# EAGLE design picker bot (EAGLE 9.6.2)
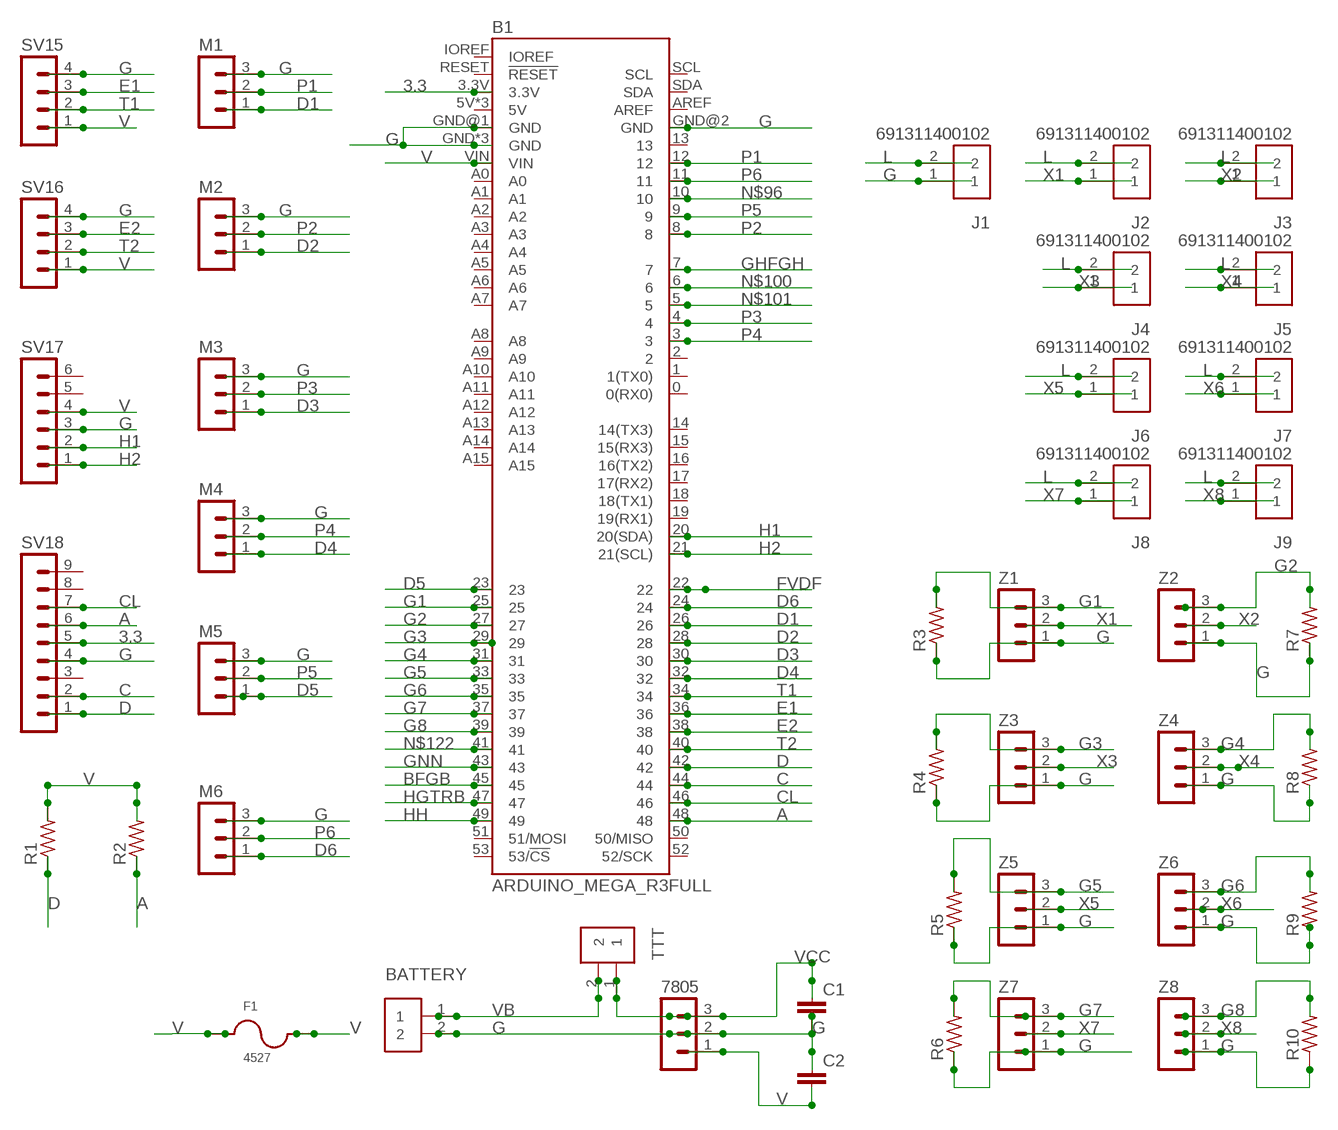
[diagram p0: schematic, sheet 1]

## Parts
7805  MA03-1  [MA03-1]
B1  ARDUINO_MEGA_R3FULL  [ARDUINO_MEGA_NO_SILK]
BATTERY  691311400102  [TERMINALBLOCK_PLUGGABLE-2-7.62MM]
C1  C-EU025-024X044  [C025-024X044]
C2  C-EU025-024X044  [C025-024X044]
F1  4527  [4527]
J1  691311400102  [TERMINALBLOCK_PLUGGABLE-2-7.62MM]
J2  691311400102  [TERMINALBLOCK_PLUGGABLE-2-7.62MM]
J3  691311400102  [TERMINALBLOCK_PLUGGABLE-2-7.62MM]
J4  691311400102  [TERMINALBLOCK_PLUGGABLE-2-7.62MM]
J5  691311400102  [TERMINALBLOCK_PLUGGABLE-2-7.62MM]
J6  691311400102  [TERMINALBLOCK_PLUGGABLE-2-7.62MM]
J7  691311400102  [TERMINALBLOCK_PLUGGABLE-2-7.62MM]
J8  691311400102  [TERMINALBLOCK_PLUGGABLE-2-7.62MM]
J9  691311400102  [TERMINALBLOCK_PLUGGABLE-2-7.62MM]
M1  MA03-1  [MA03-1]
M2  MA03-1  [MA03-1]
M3  MA03-1  [MA03-1]
M4  MA03-1  [MA03-1]
M5  MA03-1  [MA03-1]
M6  MA03-1  [MA03-1]
R1  R-US_0204/5  [0204/5]
R2  R-US_0204/5  [0204/5]
R3  R-US_0204/5  [0204/5]
R4  R-US_0204/5  [0204/5]
R5  R-US_0204/5  [0204/5]
R6  R-US_0204/5  [0204/5]
R7  R-US_0204/5  [0204/5]
R8  R-US_0204/5  [0204/5]
R9  R-US_0204/5  [0204/5]
R10  R-US_0204/5  [0204/5]
SV15  MA04-1  [MA04-1]
SV16  MA04-1  [MA04-1]
SV17  MA06-1  [MA06-1]
SV18  MA09-1  [MA09-1]
TTT  691311400102  [TERMINALBLOCK_PLUGGABLE-2-7.62MM]
Z1  MA03-1  [MA03-1]
Z2  MA03-1  [MA03-1]
Z3  MA03-1  [MA03-1]
Z4  MA03-1  [MA03-1]
Z5  MA03-1  [MA03-1]
Z6  MA03-1  [MA03-1]
Z7  MA03-1  [MA03-1]
Z8  MA03-1  [MA03-1]

## Nets
3.3: B1.3.3V SV18.5
A: B1.48 R2.1 SV18.6
BFGB: B1.45
C: B1.44 SV18.2
CL: B1.46 SV18.7
D: B1.42 R1.1 SV18.1
D1: B1.26 M1.1
D2: B1.28 M2.1
D3: B1.30 M3.1
D4: B1.32 M4.1
D5: B1.23 M5.1
D6: B1.24 M6.1
E1: B1.36 SV15.3
E2: B1.38 SV16.3
FVDF: B1.22
G: 7805.2 B1.GND B1.GND@1(GND) B1.GND@2(GND) B1.GND@3(GND) B1.GND@4(GND) BATTERY.2 C1.2 C2.1 J1.1 M1.3 M2.3 M3.3 M4.3 M5.3 M6.3 R3.1 R4.1 R5.1 R6.1 R7.1 R8.1 R9.1 R10.1 SV15.4 SV16.4 SV17.3 SV18.4 Z1.1 Z2.1 Z3.1 Z4.1 Z5.1 Z6.1 Z7.1 Z8.1
G1: B1.25 R3.2 Z1.3
G2: B1.27 R7.2 Z2.3
G3: B1.29 R4.2 Z3.3
G4: B1.31 R8.2 Z4.3
G5: B1.33 R5.2 Z5.3
G6: B1.35 R9.2 Z6.3
G7: B1.37 R6.2 Z7.3
G8: B1.39 R10.2 Z8.3
GHFGH: B1.7
GNN: B1.43
H1: B1.20(20(SDA)) SV17.2
H2: B1.21(21(SCL)) SV17.1
HGTRB: B1.47
HH: B1.49
L: J1.2 J2.2 J3.2 J4.2 J5.2 J6.2 J7.2 J8.2 J9.2
N$96: B1.10
N$100: B1.6
N$101: B1.5
N$122: B1.41
P1: B1.12 M1.2
P2: B1.8 M2.2
P3: B1.4 M3.2
P4: B1.3 M4.2
P5: B1.9 M5.2
P6: B1.11 M6.2
T1: B1.34 SV15.2
T2: B1.40 SV16.2
V: 7805.1 B1.VIN C2.2 F1.1 F1.2 R1.2 R2.2 SV15.1 SV16.1 SV17.4
VB: BATTERY.1 TTT.2
VCC: 7805.3 C1.1 TTT.1
X1: J2.1 Z1.2
X2: J3.1 Z2.2
X3: J4.1 Z3.2
X4: J5.1 Z4.2
X5: J6.1 Z5.2
X6: J7.1 Z6.2
X7: J8.1 Z7.2
X8: J9.1 Z8.2
Unconnected: B1.0(0(RX0)) B1.1(1(TX0)) B1.2 B1.5V B1.5V@1(5V) B1.5V@2(5V) B1.13 B1.14(14(TX3)) B1.15(15(RX3)) B1.16(16(TX2)) B1.17(17(RX2)) B1.18(18(TX1)) B1.19(19(RX1)) B1.50(50/MISO) B1.51(51/MOSI) B1.52(52/SCK) B1.53(53/!CS) B1.A0 B1.A1 B1.A2 B1.A3 B1.A4 B1.A5 B1.A6 B1.A7 B1.A8 B1.A9 B1.A10 B1.A11 B1.A12 B1.A13 B1.A14 B1.A15 B1.AREF B1.IOREF B1.RESET(!RESET) B1.SCL B1.SDA SV17.5 SV17.6 SV18.3 SV18.8 SV18.9

## Library data of the parts
7805 M1-M6 Z1-Z8 = con-lstb:MA03-1: PIN HEADER; OC_FARNELL: unknown; OC_NEWARK: unknown
B1 = SparkFun-Boards:ARDUINO_MEGA_R3: Arduino Mega R3 ATmega2560 R3 compatible footprint. SparkFun Products: Arduino Mega 2560 R3 <https://www.sparkfun.com/products/11061>
BATTERY J1-J9 TTT = Terminal Blocks:691311400102: 7.62MM CLOSE VERTICAL PCB HEADER WR-TBL Manufacturer's datasheet <https://katalog.we-online.com/em/datasheet/6913114001xx.pdf>; CREATED_BY: PCBLayout.com; DIGIKEY_PART_NO: 732-2823-ND; MANUFACTURER: WURTH ELEKTRONIK; MPN: 691311400102
C1 C2 = resistor (2):C-EU: CAPACITOR, European symbol; SPICEPREFIX: C
F1 = Fuse Holder:4527: FUSE HLDR CARTRIDGE 250V 5A PCB Manufacturer's datasheet <https://www.keyelco.com/userAssets/file/M65p44.pdf>; CREATED_BY: PCBLayout.com; DIGIKEY_PN: 36-4527-ND; MANUFACTURER: Keystone Electronics; MPN: 4527
R1-R10 = resistor (2):R-US_: RESISTOR, American symbol
SV15 SV16 = con-lstb:MA04-1: PIN HEADER; OC_FARNELL: unknown; OC_NEWARK: unknown
SV17 = con-lstb:MA06-1: PIN HEADER; OC_FARNELL: unknown; OC_NEWARK: unknown
SV18 = con-lstb:MA09-1: PIN HEADER; OC_FARNELL: unknown; OC_NEWARK: unknown

## Board
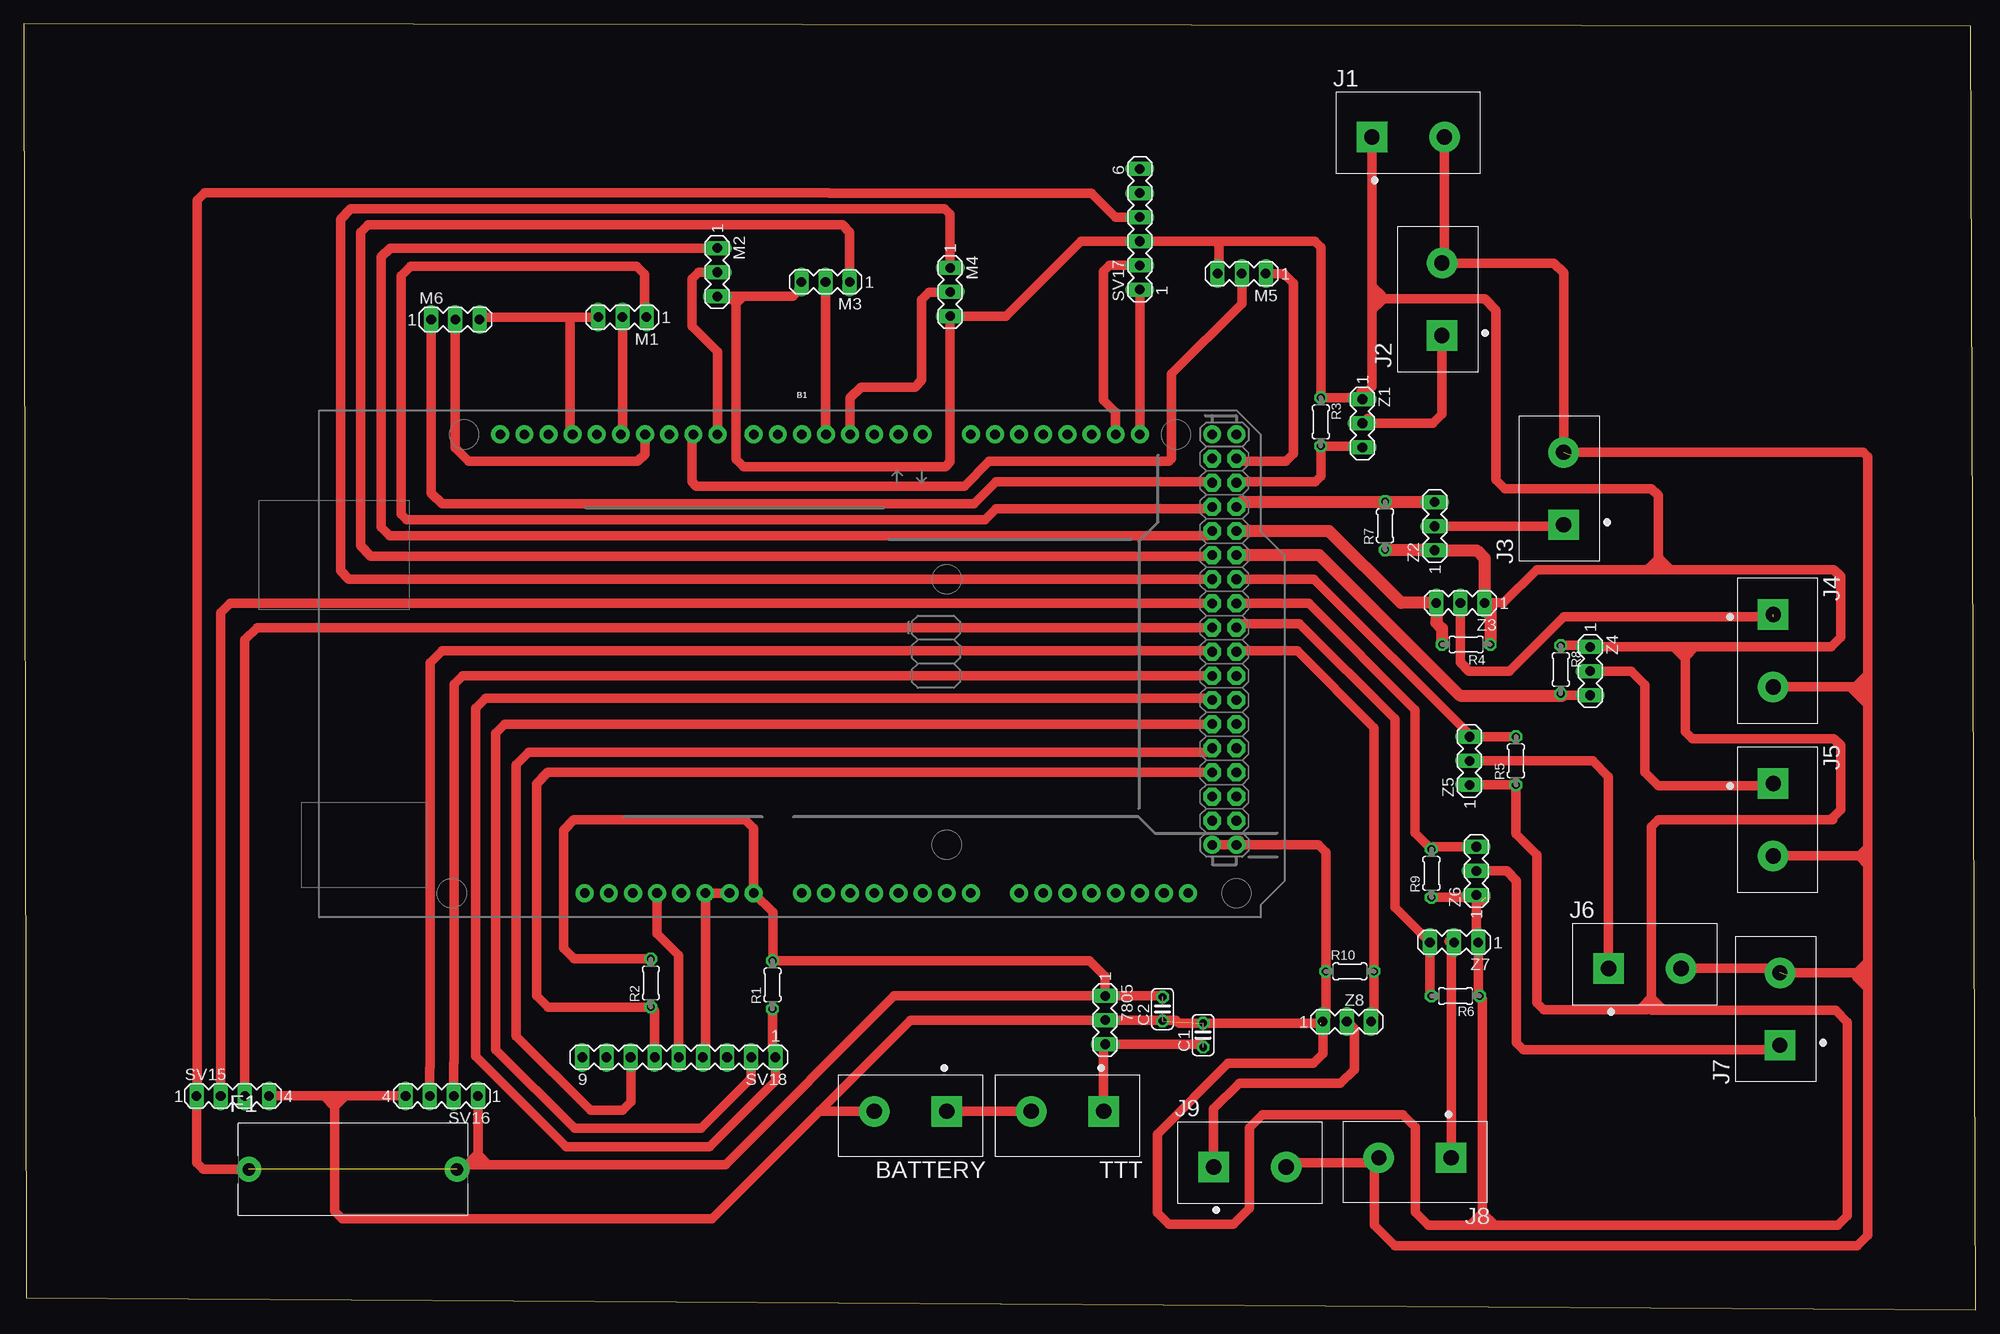
[diagram p1: board, top side]

Size 205.42 x 135.31 mm. Coordinates in mm from the lower left corner, seen from the top.
Outline: 0.25,1.27 205.42,0 204.91,135.05 0,135.31 0.25,1.27
Copper layers (1*16): Top 0.035mm / dielectric 1.5mm / Bottom 0.035mm
Design rules "default": minimum track width 6mil, minimum drill 0.35mm, track to track 6mil, track to pad 6mil, pad to pad 6mil, via to via 6mil, smd to smd 6mil, copper to edge 40mil, drill to drill 6mil, minimum pad ring 10mil, minimum via ring 8mil, stop-mask expansion 4mil, vias tented up to drill 0mil, thermal gap 10mil

### Footprints (pad centres in the part's own frame; a part is rotated, then mirrored left to right if it is on the bottom)
MA03-1 = drill 1.016 long: 1 -2.54,0; 2 0,0; 3 2.54,0
ARDUINO_MEGA_NO_SILK = drill 1.016 pad 1.88: 0 13.97,24.13; 1 11.43,24.13; 2 8.89,24.13; 3 6.35,24.13; 3.3V -13.97,-24.13; 4 3.81,24.13; 5 1.27,24.13; 5V -11.43,-24.13; 5V@1 44.45,24.13; 5V@2 46.99,24.13; 6 -1.27,24.13; 7 -3.81,24.13; 8 -7.62,24.13; 9 -10.16,24.13; 10 -12.7,24.13; 11 -15.24,24.13; 12 -17.78,24.13; 13 -20.32,24.13; 14 19.05,24.13; 15 21.59,24.13; 16 24.13,24.13; 17 26.67,24.13; 18 29.21,24.13; 19 31.75,24.13; 20 34.29,24.13; 21 36.83,24.13; A0 1.27,-24.13; A1 3.81,-24.13; A2 6.35,-24.13; A3 8.89,-24.13; A4 11.43,-24.13; A5 13.97,-24.13; A6 16.51,-24.13; A7 19.05,-24.13; A8 24.13,-24.13; A9 26.67,-24.13; A10 29.21,-24.13; A11 31.75,-24.13; A12 34.29,-24.13; A13 36.83,-24.13; A14 39.37,-24.13; A15 41.91,-24.13; AREF -25.4,24.13; GND -8.89,-24.13; GND@1 -6.35,-24.13; GND@2 44.45,-19.05; GND@3 46.99,-19.05; GND@4 -22.86,24.13; IOREF -19.05,-24.13; NC -21.59,-24.13; RESET -16.51,-24.13; SCL -30.48,24.13; SDA -27.94,24.13; VIN -3.81,-24.13 | drill 1.016 pad 1.88 octagon: 22 44.45,21.59; 23 46.99,21.59; 24 44.45,19.05; 25 46.99,19.05; 26 44.45,16.51; 27 46.99,16.51; 28 44.45,13.97; 29 46.99,13.97; 30 44.45,11.43; 31 46.99,11.43; 32 44.45,8.89; 33 46.99,8.89; 34 44.45,6.35; 35 46.99,6.35; 36 44.45,3.81; 37 46.99,3.81; 38 44.45,1.27; 39 46.99,1.27; 40 44.45,-1.27; 41 46.99,-1.27; 42 44.45,-3.81; 43 46.99,-3.81; 44 44.45,-6.35; 45 46.99,-6.35; 46 44.45,-8.89; 47 46.99,-8.89; 48 44.45,-11.43; 49 46.99,-11.43; 50 44.45,-13.97; 51 46.99,-13.97; 52 44.45,-16.51; 53 46.99,-16.51
TERMINALBLOCK_PLUGGABLE-2-7.62MM = drill 1.6 pad 3.2 square: 1 -3.81,0 | drill 1.6 pad 3.2: 2 3.81,0
C025-024X044 = drill 0.813 octagon: 1 -1.27,0; 2 1.27,0
4527 = drill 1.3 pad 2.6: 1 -10.95,0; 2 10.95,0
0204/5 = drill 0.813 octagon: 1 -2.54,0; 2 2.54,0
MA04-1 = drill 1.016 long: 1 -3.81,0; 2 -1.27,0; 3 1.27,0; 4 3.81,0
MA06-1 = drill 1.016 long: 1 -6.35,0; 2 -3.81,0; 3 -1.27,0; 4 1.27,0; 5 3.81,0; 6 6.35,0
MA09-1 = drill 1.016 long: 1 -10.16,0; 2 -7.62,0; 3 -5.08,0; 4 -2.54,0; 5 0,0; 6 2.54,0; 7 5.08,0; 8 7.62,0; 9 10.16,0

### Placement (x,y rotation side)
7805  113.79,30.48 270 top
B1  80.62,67.97 0 top
BATTERY  93.32,20.88 180 top
C1  124.1,28.91 90 top
C2  119.84,31.65 90 top
F1  34.65,14.78 0 top
J1  145.69,123.39 0 top
J2  149.25,106.32 90 top
J3  162.05,86.41 90 top
J4  184.1,69.34 270 top
J5  184.1,51.56 270 top
J6  170.59,35.92 0 top
J7  184.81,31.65 90 top
J8  146.41,16 180 top
J9  129.03,15.04 0 top
M1  62.99,104.44 180 top
M2  72.97,109.17 270 top
M3  84.38,108.15 180 top
M4  97.49,107.09 270 top
M5  128.17,109.02 180 top
M6  45.42,104.19 0 top
R1  78.79,34.19 90 top
R2  65.99,34.39 90 top
R3  136.5,93.42 270 top
R4  151.79,70 180 top
R5  157.02,57.76 90 top
R6  150.67,33.02 180 top
R7  143.26,82.5 90 top
R8  161.75,67.36 270 top
R9  148.13,45.92 90 top
R10  139.55,35.61 0 top
SV15  22,22.5 0 top
SV16  43.99,22.5 180 top
SV17  117.45,113.69 90 top
SV18  68.94,26.57 180 top
TTT  109.83,20.88 180 top
Z1  140.87,93.27 270 top
Z2  148.49,82.45 90 top
Z3  151.18,74.37 180 top
Z4  164.85,67.21 270 top
Z5  152.15,57.76 90 top
Z6  152.86,46.18 90 top
Z7  150.52,38.66 180 top
Z8  139.24,30.33 0 top

### Tracks (layer width: path | path; a pad name or v marks a point on that pad's centre or on a via)
3.3
  Top 1.016: SV18.5 68.94,37.29 66.65,39.57 B1.3.3V
A
  Top 1.016: 66.4,27.74 SV18.6 66.4,31.44 R2.1 55.17,31.85 53.95,33.07 53.95,55.37 55.12,56.54 B1.48
C
  Top 1.016: SV18.2 76.56,24.38 71.27,19.1 57.96,19.1 49.68,27.38 49.68,60.68 50.62,61.62 B1.44
CL
  Top 1.016: SV18.7 63.86,27.43 | B1.46 124.66,58.67 53.14,58.67 51.82,57.35 51.82,28.8 59.64,20.98 62.99,20.98 63.91,21.89 63.91,26.52 SV18.7 | SV18.7 63.86,25.86
D
  Top 1.016: B1.42 124.87,64.36 48.62,64.36 47.55,63.3 47.55,26.67 57.05,17.17 72.19,17.17 79.1,24.08 SV18.1 78.89,26.77 78.79,27.38 R1.1
D1
  Top 1.016: M1.1 65.33,104.65 65.33,108.94 64.49,109.78 40.72,109.78 39.73,108.79 39.73,83.69 40.31,83.11 101.14,83.11 102.31,84.28 124.87,84.28 B1.26
D2
  Top 1.016: M2.1 38.53,111.71 37.59,110.77 37.59,82.35 38.51,81.43 124.56,81.43 B1.28
D3
  Top 1.016: M3.1 86.92,113.39 86.16,114.15 36.22,114.15 35.46,113.39 35.46,80.37 36.53,79.3 124.97,79.3 B1.30
D4
  Top 1.016: M4.1 97.49,115.24 96.9,115.82 34.42,115.82 33.32,114.73 33.32,77.75 34.21,76.86 B1.32
D5
  Top 1.016: M5.1 132.61,109.02 133.6,108.03 133.6,90.04 132.82,89.26 127.91,89.26 B1.23
D6
  Top 1.016: M6.1 42.88,85.93 44.02,84.78 99.97,84.78 102.31,87.12 124.97,87.12 B1.24
E1
  Top 1.016: B1.36 24.56,71.78 23.27,70.48 SV15.3
E2
  Top 1.016: B1.38 124.97,69.34 44.02,69.34 42.77,68.1 42.77,25.5 42.72,25.45 SV16.3
G  (3 unrouted)
  Top 1.016: M1.3 57.76,104.44 | 57.76,104.44 57.51,104.19 57.51,92.35 B1.GND@4 | M6.3 48.21,104.44 57.76,104.44 | SV18.4 71.73,26.82 B1.GND B1.GND@1 | 125.37,112.42 SV17.3 111.25,112.42 103.38,104.55 M4.3 97.49,89.23 96.98,88.72 75.74,88.72 74.96,89.51 74.96,105.84 | 125.37,112.42 125.78,112.01 125.78,109.17 M5.3 | 140.72,95.96 R3.1 136.5,111.81 135.89,112.42 125.37,112.42 | 140.72,95.96 Z1.1 | 113.39,30.63 113.23,30.48 | R9.1 153.87,43.38 | 153.47,43.03 Z6.1 152.86,38.86 Z7.1 153.06,33.17 R6.1 153.52,32.71 153.52,10.21 | 136.45,30.23 137.01,30.78 R10.1 137.01,48.16 136.25,48.92 B1.GND@3 | Z8.1 136.63,30.4 136.4,30.17 C1.2 121.56,30.17 121.26,30.48 7805.2 113.23,30.48 | 136.45,30.07 Z8.1 | J1.1 141.88,107.49 | 141.88,107.49 141.88,106.37 | 141.88,106.37 141.88,105.21 | 141.88,105.21 141.88,97.13 140.72,95.96 | 153.52,10.21 153.52,9.6 | 154.23,8.89 153.52,9.6 | 154.23,8.89 154.79,8.89 | 154.79,8.89 190.91,8.89 191.92,9.91 191.92,30.28 190.7,31.5 172.31,31.5 | 172.31,31.5 171.3,31.5 171.3,32.82 | 171.04,77.88 159.21,77.88 155.7,74.37 Z3.1 | 171.04,77.88 172.01,77.88 | 172.01,77.88 173.33,77.88 | 173.33,77.88 190.5,77.88 191.21,77.16 191.21,70.76 190.2,69.75 175.87,69.75 | Z8.1 136.7,26.92 135.74,25.96 126.75,25.96 119.28,18.49 119.28,10.21 120.5,8.99 127.3,8.99 128.98,10.67 128.98,19.15 130.35,20.52 145.14,20.52 146.46,19.2 146.46,10.26 147.83,8.89 152.25,8.89 | 152.25,8.89 152.81,8.89 | 152.81,8.89 154.23,8.89 | R8.1 164.69,69.9 Z4.1 173.58,69.75 | 173.58,69.75 174.85,69.75 | 174.85,69.75 175.87,69.75 | B1.GND@2 127.3,48.92 127.46,48.77 B1.GND@3 | B1.GND@3 127.91,49.22 127.91,49.43 127.61,49.12 B1.GND@3
  Top 1.016: 141.88,106.37 142.85,106.37 | 142.85,106.37 153.75,106.37 154.94,105.18 154.94,87.35 155.88,86.41 171.3,86.41 172.01,85.7 172.01,79.04 | 172.01,77.88 172.01,79.04 | 83.72,20.88 72.44,9.6 33.5,9.6 32.74,10.36 32.74,21.39 | 83.72,20.88 93.32,30.48 113.23,30.48 | SV15.4 31.62,22.5 | 31.62,22.5 32.74,22.5 | 32.74,22.5 33.86,22.5 | 33.86,22.5 SV16.4 | 174.85,69.75 174.85,68.73 | 174.85,68.48 174.85,60.81 175.56,60.1 190.5,60.1 191.21,59.38 191.21,52.63 190.35,51.76 190.35,51.56 172.01,51.56 171.3,50.85 171.3,32.82 | 153.52,9.6 152.81,8.89 | 170.28,31.55 159.97,31.55 159.21,32.31 159.21,47.9 157.02,50.09 R5.1 Z5.1 | 170.28,31.55 170.79,31.55 | 141.88,107.49 142.09,107.49 142.85,106.73 142.85,106.37 | 142.85,106.37 142.85,106.17 141.88,105.21 | 172.01,79.04 171.04,78.08 171.04,77.88 | 172.01,79.04 172.16,79.04 173.33,77.88 | 173.58,69.75 174.85,68.48 | 174.85,68.48 174.85,68.73 | 174.85,68.73 175.87,69.75 | 171.3,32.82 170.28,31.8 170.28,31.55 | 171.3,32.82 172.31,31.8 172.31,31.5 | 153.52,10.21 152.25,8.94 152.25,8.89 | 153.52,10.21 154.79,8.94 154.79,8.89 | 83.72,20.88 BATTERY.2 | M2.3 74.17,106.63 | 74.17,106.63 75.29,106.63 | 75.29,106.63 75.74,106.63 | 75.74,106.63 80.95,106.63 81.84,107.52 M3.3 | 75.29,106.63 74.96,106.3 74.96,105.84 | 74.96,105.84 75.74,106.63 | 74.96,105.84 74.17,106.63 | 32.74,22.5 32.74,21.39 | 32.74,21.39 33.86,22.5 | 32.74,21.39 31.62,22.5
  Top 1.27: R7.1 148.44,79.96 Z2.1 152.91,79.91 153.72,79.1 Z3.1 154.33,73.76 R4.1 | Z1.1 140.87,96.52
G1
  Top 1.016: Z1.3 140.72,90.88 R3.2 136.5,87.71 135.92,87.12 127.71,87.12 B1.25
G2
  Top 1.27: Z2.3 143.31,84.99 | 143.31,84.99 R7.2 | 143.31,84.99 128.12,84.99 B1.27
G3
  Top 1.27: R4.2 149.25,71.68 148.64,72.29 Z3.3 144.93,74.37 137.36,81.94 B1.29
G4
  Top 1.016: 161.95,64.62 R8.2 161.9,64.67 Z4.3
  Top 1.27: B1.31 136.35,79.4 151.13,64.62 161.95,64.62
G5
  Top 1.016: B1.33 135.79,76.86 152.26,60.39 Z5.3 R5.2
G6
  Top 1.016: Z6.3 148.39,48.72 R9.2 146.41,50.19 146.41,63.14 135.23,74.32 B1.35
G7
  Top 1.016: R6.2 147.98,33.17 Z7.3 144.27,42.37 144.27,62.18 134.26,72.19 128.02,72.19 B1.37
G8
  Top 1.016: Z8.3 142.09,30.63 R10.2 142.09,61.26 134.01,69.34 127.71,69.34 B1.39
H1
  Top 1.016: SV17.2 114.27,109.88 113.64,109.25 113.64,95.71 114.91,94.44 B1.20
H2
  Top 1.016: SV17.1 B1.21
L  (2 unrouted)
  Top 1.016: J9.2 133.3,15.49 142.09,15.49 J8.2 142.85,16 | J1.2 149.5,110.39 J2.2 161.01,110.13 162.05,109.09 162.05,89.97 162.76,89.97 | J3.2 193.6,90.22 194.06,89.76 194.06,66.85 | 194.06,66.85 194.06,65.84 | 194.06,65.84 194.06,63.65 | 194.06,63.65 194.06,48.56 | 194.06,48.56 194.06,48.01 | 194.06,48.01 194.06,46.84 | 194.06,46.84 194.06,36.63 | 194.06,36.63 194.06,35.2 | 194.06,35.2 194.06,33.83 | 194.06,33.83 194.06,7.85 192.96,6.76 144.27,6.76 142.14,8.89 142.14,16 142.85,16.71 142.85,16 | J7.2 192.89,35.46 | 192.89,35.46 193.8,35.46 194.06,35.2 | 184.81,64.82 J4.2 192.18,65.53 | 192.18,65.53 194.06,63.65 | J5.2 193.14,47.75 | 193.14,47.75 193.8,47.75 194.06,48.01 | J6.2 185.52,35.92 185.52,35.2 | 142.85,16 142.85,15.29 | 192.89,35.46 194.06,36.63 | 192.89,35.46 192.89,35 194.06,33.83 | 193.14,47.75 193.95,48.56 194.06,48.56 | 193.14,47.75 194.06,46.84 | 192.18,65.53 192.74,65.53 | 192.74,65.53 194.06,66.85 | 192.74,65.53 193.19,65.53 193.4,65.33 193.55,65.33 194.06,65.84
P1
  Top 1.016: M1.2 62.99,92.25 B1.12
P2
  Top 1.016: M2.2 71.02,109.17 70.31,108.46 70.31,103.48 73,100.79 B1.8
P3
  Top 1.016: 84.38,106.02 M3.2 84.38,92.15 B1.4
P4
  Top 1.016: M4.2 97.43,107.04 95.28,107.04 94.49,106.25 94.49,97.79 93.78,97.08 88.09,97.08 86.97,95.96 B1.3
P5
  Top 1.016: M5.2 128.17,105.87 120.8,98.5 120.8,89.56 120.5,89.26 101.6,89.26 99.01,86.66 70.76,86.66 70.31,87.12 70.31,91.95 B1.9
P6
  Top 1.016: M6.2 45.42,90.68 46.84,89.26 64.62,89.26 65.38,90.02 B1.11
T1
  Top 1.016: B1.34 21.72,74.32 20.73,73.33 SV15.2
T2
  Top 1.016: B1.40 46.2,66.7 45.31,65.81 45.31,26.01 45.26,25.96 SV16.2
V  (1 unrouted)
  Top 1.016: 76.71,43.94 B1.VIN | R2.2 57.91,36.93 56.79,38.05 56.79,50.47 57.89,51.56 75.92,51.56 76.81,50.67 B1.VIN | SV17.4 114.91,114.96 112.37,117.5 84.73,117.5 84.68,117.55 19.05,117.55 18.24,116.74 18.24,22.55 SV15.1 18.19,15.49 18.9,14.78 F1.1 | 7805.1 119.74,33.02 C2.2 | 47.98,22.68 SV16.1 47.8,16.31 | 47.98,15.29 48.82,15.29 | 48.82,15.29 73.86,15.29 91.59,33.02 7805.1 | B1.VIN 78.84,41.81 78.84,36.78 R1.2 112.17,36.73 113.79,35.1 7805.1 | F1.2 46.1,15.29 46.71,15.29 | 46.71,15.29 47.98,15.29 | 47.8,16.31 47.8,15.47 47.98,15.29 | 47.8,16.31 48.82,15.29 | 47.8,16.31 47.73,16.31 46.71,15.29
VB
  Top 1.016: BATTERY.1 TTT.2
VCC
  Top 1.016: C1.1 123.8,27.94 7805.3 113.64,27.79 TTT.1
X1
  Top 1.016: 141.43,93.83 Z1.2 148.29,93.27 149.25,94.23 J2.1
X2
  Top 1.016: Z2.2 161.9,82.45 J3.1
X3  (1 unrouted)
  Top 1.016: Z3.2 151.18,68.12 152.1,67.21 156.36,67.21 162.05,72.9 184.1,72.9
X4
  Top 1.016: Z4.2 169.16,67.21 170.59,65.79 170.59,56.54 172.01,55.12 183.85,55.12 J5.1
X5
  Top 1.016: J6.1 166.78,56.08 165.1,57.76 Z5.2
X6
  Top 1.016: Z6.2 156.06,46.18 157.07,45.16 157.07,28.09 157.78,27.38 184.81,27.38 185.52,28.09 185.06,28.09 J7.1
X7
  Top 1.016: J8.1 150.22,38.51 149.96,38.76 150.42,38.76 Z7.2
X8
  Top 1.016: J9.1 125.22,21.13 127.91,23.82 138.58,23.82 140,25.25 140,29.57 Z8.2